# Altium schematic sheet USB.SchDoc
size A4
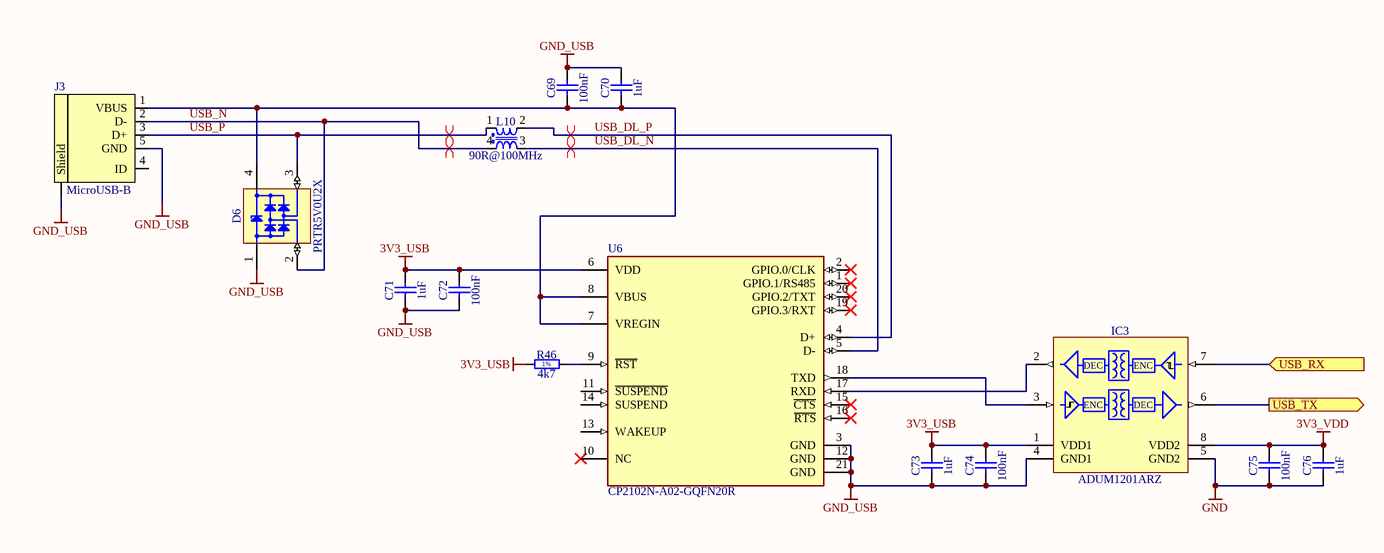
[diagram p0: USB.SchDoc]

## Parts
C69  100nF  [CAPC1005X55N]
C70  1uF  [CAPC1005X55N]
C71  1uF  [CAPC1005X55N]
C72  100nF  [CAPC1005X55N]
C73  1uF  [CAPC1005X55N]
C74  100nF  [CAPC1005X55N]
C75  100nF  [CAPC1005X55N]
C76  1uF  [CAPC1005X55N]
D6  PRTR5V0U2X  [SOT190P230X110-4N]
IC3  ADUM1201ARZ  [SOIC127P600X175-8N]
J3  MicroUSB-B  [USB-Micro-B-RA-SMD-PiP]
L10  90R@100MHz  [IND_MURATA_DLW21S]
R46  4k7  [RESC1005X40N]
U6  CP2102N-A02-GQFN20R  [FP-CP2102N-A02-GQFN20R-MFG]

## Ports
USB_RX (in), USB_TX (out)

## Nets
3V3_USB: C71.2 C72.2 C73.2 C74.2 IC3.1(VDD1) R46.1 U6.6(VDD)
3V3_VDD: C75.2 C76.2 IC3.8(VDD2)
GND: C75.1 C76.1 IC3.5(GND2)
GND_USB: C69.2 C70.2 C71.1 C72.1 C73.1 C74.1 D6.1(GND) IC3.4(GND1) J3.5(GND) J3.6(Shield) U6.3(GND) U6.12(GND) U6.21(GND)
USB_DL_N: L10.3 U6.5(D-)
USB_DL_P: L10.2 U6.4(D+)
USB_N: D6.2(I/O1) J3.2(D-) L10.4
USB_P: D6.3(I/O2) J3.3(D+) L10.1
USB_RX: IC3.7(VIA) ; port USB_RX
USB_TX: IC3.6(VOB) ; port USB_TX
NetC69_1: C69.1 C70.1 D6.4(VCC) J3.1(VBUS) U6.7(VREGIN) U6.8(VBUS)
NetIC3_2: IC3.2(VOA) U6.17(RXD)
NetIC3_3: IC3.3(VIB) U6.18(TXD)
NetR46_2: R46.2 U6.9(~{RST})

Not connected (* = marked no-connect by the designer): J3 4(ID); U6 1(GPIO.1/RS485)* 2(GPIO.0/CLK)* 10(NC)* 11(~{SUSPEND}) 13(WAKEUP) 14(SUSPEND) 15(~{CTS})* 16(~{RTS})* 19(GPIO.3/RXT)* 20(GPIO.2/TXT)*

## Layout directives
differential pair: USB_DL_N, USB_DL_P, USB_N, USB_P

## Notes on the sheet
- (in symbol ADUM1201ARZ) DEC; ENC
- (in symbol R0402_4K7_1%_0.0625W_100PPM) 1%

## Library data of the parts
C69 C72 C74 C75 = CC0402_100NF_16V_10%_X5R: Non-polarised capacitor; Part Description: SMD Multilayer Chip Ceramic Capacitor; Manufacturer: GENERIC; Manufacturer1 Part Number: GRM155R61C104KA88D; Voltage: 16V; TC: X5R; Tolerance: ±10%; Part Number: CC0402_100NF_16V_10%_X5R; Component Kind: Standard; Component Type: Standard; Pin Count: 2; Value: 100nF; Status: None; Manufacturer Part Number: CC0402_100NF_16V_10%_X5R; Case: 0402; Mounted: Yes; Socket: No; SMD: Yes; Sense: No; Manufacturer1 Example: MURATA; Manufacturer1 ComponentHeight: 0.55mm; HelpURL: \\cern.ch\dfs\Applications\Altium\Datasheets\CC0402_X5R_MURATA_GRM.pdf; Author: CERN DEM JLC; CreateDate: 10.12.2013; LatestRevisionDate: 10.12.2013
C70 C71 C73 C76 = CC0402_1UF_16V_10%_X5R: Non-polarised capacitor; Part Description: SMD Multilayer Chip Ceramic Capacitor; Manufacturer: GENERIC; Manufacturer1 Part Number: C1005X5R1C105KT; Voltage: 16V; TC: X5R; Tolerance: ±10%; Part Number: CC0402_1UF_16V_10%_X5R; Component Kind: Standard; Component Type: Standard; Pin Count: 2; Value: 1uF; Status: Preferred; Manufacturer Part Number: CC0402_1UF_16V_10%_X5R; Case: 0402; Mounted: Yes; Socket: No; SMD: Yes; Sense: No; Manufacturer1 Example: TDK; Manufacturer1 ComponentHeight: 0.55mm; HelpURL: \\cern.ch\dfs\Applications\Altium\Datasheets\CC0402_X5R_TDK_C.pdf; Author: CERN DEM JLC; CreateDate: 25.10.2012; LatestRevisionDate: 25.10.2012
D6 = PRTR5V0U2X: Ultra Low Capacitance Double Rail-to-Rail ESD Protection Diode; Part Description: Ultra Low Capacitance (1pF) Double Rail-to-Rail ESD Protection Diode (8kV); Manufacturer: NXP SEMICONDUCTORS; Voltage: 5.5V; PressFit: No; Bonding: No; Part Number: PRTR5V0U2X; Component Kind: Standard; Component Type: Standard; Device: PRTR5V0U2X; PackageDescription: SOT143B, SOT, 1.90mm Pitch; 4 Pin, 1.30mm W X 2.90mm L X 1.10mm H body, IPC Medium Density; Manufacturer Part Number: PRTR5V0U2X; Pin Count: 4; Case: SOT143B; Mounted: Yes; Socket: No; SMD: Yes; Sense: No; ComponentHeight: 1.1mm; HelpURL: \\cern.ch\dfs\Applications\Altium\Datasheets\PRTR5V0U2X.pdf; Author: CERN DEM JLC; CreateDate: 22.03.2011; LatestRevisionDate: 22.03.2011
IC3 = ADUM1201ARZ: Dual-Channel Digital Isolators; Manufacturer: ANALOG DEVICES; PressFit: No; Bonding: No; Part Number: ADUM1201ARZ; Component Kind: Standard; Component Type: Standard; Device: ADUM1201ARZ; PackageDescription: SOIC 8, Pitch 1.27mm - Body 4x5mm, IPC Medium Density; Part Description: Dual-Channel Digital Isolator; Manufacturer Part Number: ADUM1201ARZ; Pin Count: 8; Case: SOIC8; Mounted: Yes; Socket: No; SMD: Yes; Sense: No; ComponentHeight: 1.75mm; Author: CERN DEM BC; HelpURL: \\cern.ch\dfs\Applications\Altium\Datasheets\ADUM1201ARZ.pdf; CreateDate: 31.07.2015; LatestRevisionDate: 31.07.2015
J3 = MiniUSB-AB-SMT: MicroUSB-B-SMT; Manufacturer: Allen Creations Corp.; Manufacturer Part Number: AJU55-BS2111-L; 2nd source part number: 609-4616-1-ND; Artikkelnr Noca: 55029020; Artikkelnr Simpro: N.A.; Part Number: USB-Micro-B-RA-SMD-PiP; Datasheet: \\hizz\pro\app9717\Datasheet\connectores\Allen Creations Corp\AJU-211.pdf; Footprint Doc: USB-Micro-B-RA-SMD-PiP; LatestRevisionDate: 2016-04-21; Pin Count: 5; Publisher: Nordic Semiconductor; Published: 2014-10-07; Value: MicroUSB-B; Note: *; Supplier: Cabcon; Supplier part number: AJU55-BS2111-L; 2nd source Supplier: Digi-Key
L10 = IND_MURATA_DLW21SN900SQ2L: Inductor Common Mode; Part Description: Wire Wound Common Mode Choke Coil (DLW21S Series); Manufacturer: MURATA; Power: 330mA; Resistance: 0.35R; Tolerance: ±25%; Part Number: IND_MURATA_DLW21SN900SQ2L; Component Kind: Standard; Component Type: Standard; Pin Count: 4; Value: 90R@100MHz; Status: None; Manufacturer Part Number: DLW21SN900SQ2L; Case: 0805; Mounted: Yes; Socket: No; SMD: Yes; Sense: No; ComponentHeight: 1.4mm; HelpURL: \\cern.ch\dfs\Applications\Altium\Datasheets\IND_MURATA_DLW21S.pdf; Author: CERN DEM JLC; CreateDate: 01.07.2014; LatestRevisionDate: 01.07.2014
R46 = R0402_4K7_1%_0.0625W_100PPM: Resistor - 1%; Part Description: General Purpose Thick Film Chip Resistor; Manufacturer: GENERIC; Manufacturer1 Part Number: 232270674702L; TC: ±100ppm/°C; PressFit: No; Part Number: R0402_4K7_1%_0.0625W_100PPM; Component Kind: Standard; Component Type: Standard; Pin Count: 2; Value: 4k7; Status: Not Recommended; Power: 0.0625W; Tolerance: ±1%; Manufacturer Part Number: R0402_4K7_1%_0.0625W_100PPM; Case: 0402; Mounted: Yes; Sense: No; Socket: No; SMD: Yes; Manufacturer1 Example: YAGEO PHYCOMP; Manufacturer1 ComponentHeight: 0.4mm; HelpURL: \\cern.ch\dfs\Applications\Altium\Datasheets\R0402_Phycomp_RC0402.pdf; Author: CERN DEM JLC; CreateDate: 03.12.2007; LatestRevisionDate: 17.10.2012
U6 = CMP-08107-000007-1: IC USB TO UART BRIDGE QFN20